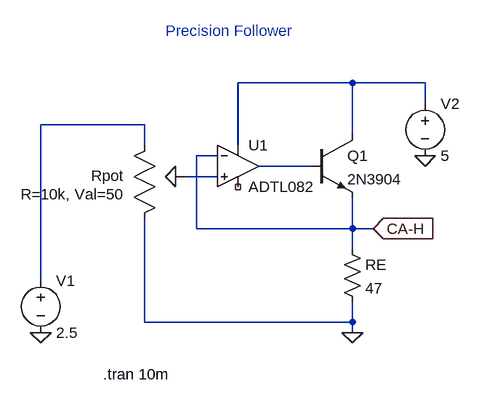
[diagram p0: schematic precision_follower_ltspice.asc]
precision_follower_ltspice.asc, the LTspice schematic file:
Version 4
SHEET 1 880 680
WIRE 416 128 240 128
WIRE 528 128 416 128
WIRE 528 160 528 128
WIRE 96 192 -64 192
WIRE 416 208 416 128
WIRE 96 224 96 192
WIRE 240 224 240 128
WIRE 208 240 176 240
WIRE 352 256 272 256
WIRE 208 272 160 272
WIRE 176 352 176 240
WIRE 416 352 416 304
WIRE 416 352 176 352
WIRE 448 352 416 352
WIRE 416 384 416 352
WIRE -64 432 -64 192
WIRE 96 496 96 336
WIRE 416 496 416 464
WIRE 416 496 96 496
WIRE 416 512 416 496
FLAG -64 512 0
FLAG 528 240 0
FLAG 416 512 0
FLAG 448 352 CA-H
IOPIN 448 352 In
SYMBOL Opamps\\ADTL082 240 192 R0
SYMATTR InstName U1
SYMBOL voltage -64 416 R0
SYMATTR InstName V1
SYMATTR Value 2.5
SYMBOL voltage 528 144 R0
SYMATTR InstName V2
SYMATTR Value 5
SYMBOL potentiometer 112 240 M0
WINDOW 0 47 31 Left 2
WINDOW 39 47 59 Left 2
SYMATTR InstName Rpot
SYMATTR SpiceLine R=10k, Val=50
SYMBOL npn 352 208 R0
SYMATTR InstName Q1
SYMATTR Value 2N3904
SYMBOL res 400 368 R0
SYMATTR InstName RE
SYMATTR Value 47
TEXT 128 48 Left 2 ;Precision Follower
TEXT 32 576 Left 2 !.tran 10m

The netlist it stands for:
* precision_follower_ltspice.asc
XU1 N004 CA-H N001 NC_01 N003 ADTL082  ; pins In+ In- V+ V- OUT
V1 N002 0 2.5
V2 N001 0 5
XRpot N002 N004 0 potentiometer R=10k, Val=50  ; pins 1 2 3
Q1 N001 N003 CA-H 0 2N3904
RE CA-H 0 47
.model NPN NPN
.model PNP PNP
.lib standard.bjt
* Precision Follower
.tran 10m
.lib ADI.lib
.backanno
.end